# EAGLE design 1-1 (EAGLE 9.6.2)
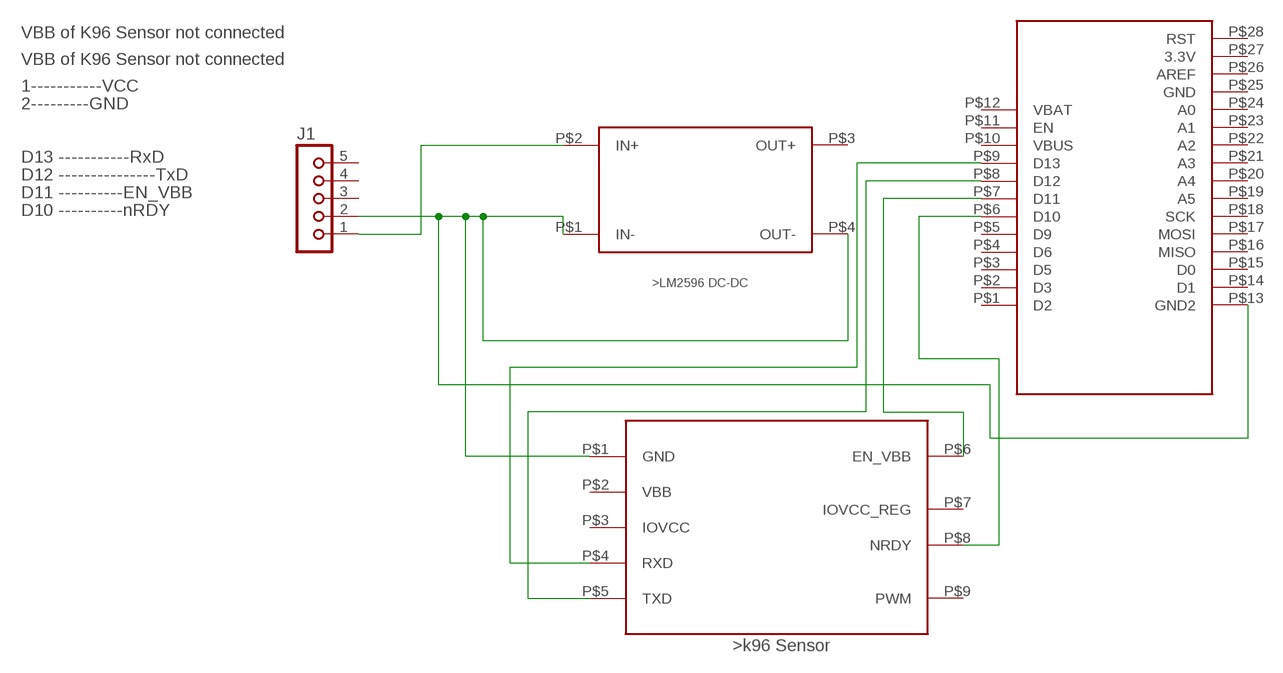
[diagram p0: schematic, sheet 1]

## Parts
DCDC1  DCDC  [DCDC]
FEATHER1  FEATHER  [FEATHER]
J1  JU05  [JU05]
K96SENSOR1  K96SENSOR  [K96SENSOR]

## Nets
N$1: DCDC1.P$2(IN+) J1.1
N$2: DCDC1.P$1(IN-) DCDC1.P$4(OUT-) FEATHER1.P$13(GND2) J1.2 K96SENSOR1.P$1(GND)
N$3: FEATHER1.P$6(D10) K96SENSOR1.P$8(NRDY)
N$5: FEATHER1.P$9(D13) K96SENSOR1.P$4(RXD)
N$6: FEATHER1.P$8(D12) K96SENSOR1.P$5(TXD)
N$7: FEATHER1.P$7(D11) K96SENSOR1.P$6(EN_VBB)
Unconnected: DCDC1.P$3(OUT+) FEATHER1.P$1(D2) FEATHER1.P$2(D3) FEATHER1.P$3(D5) FEATHER1.P$4(D6) FEATHER1.P$5(D9) FEATHER1.P$10(VBUS) FEATHER1.P$11(EN) FEATHER1.P$12(VBAT) FEATHER1.P$14(D1) FEATHER1.P$15(D0) FEATHER1.P$16(MISO) FEATHER1.P$17(MOSI) FEATHER1.P$18(SCK) FEATHER1.P$19(A5) FEATHER1.P$20(A4) FEATHER1.P$21(A3) FEATHER1.P$22(A2) FEATHER1.P$23(A1) FEATHER1.P$24(A0) FEATHER1.P$25(GND) FEATHER1.P$26(AREF) FEATHER1.P$27(3.3V) FEATHER1.P$28(RST) J1.3 J1.4 J1.5 K96SENSOR1.P$2(VBB) K96SENSOR1.P$3(IOVCC) K96SENSOR1.P$7(IOVCC_REG) K96SENSOR1.P$9(PWM)

## Notes on the sheet
- VBB of K96 Sensor not connected
- VBB of K96 Sensor not connected
- 1-----------VCC
- 2---------GND
- D13 -----------RxD
- D12 ---------------TxD
- D11 ----------EN_VBB
- D10 ----------nRDY

## Library data of the parts
DCDC1 = untitled:DCDC
FEATHER1 = untitled:FEATHER
J1 = con-lsta:JU05: PIN HEADER; OC_FARNELL: unknown; OC_NEWARK: unknown
K96SENSOR1 = untitled:K96SENSOR

## Board
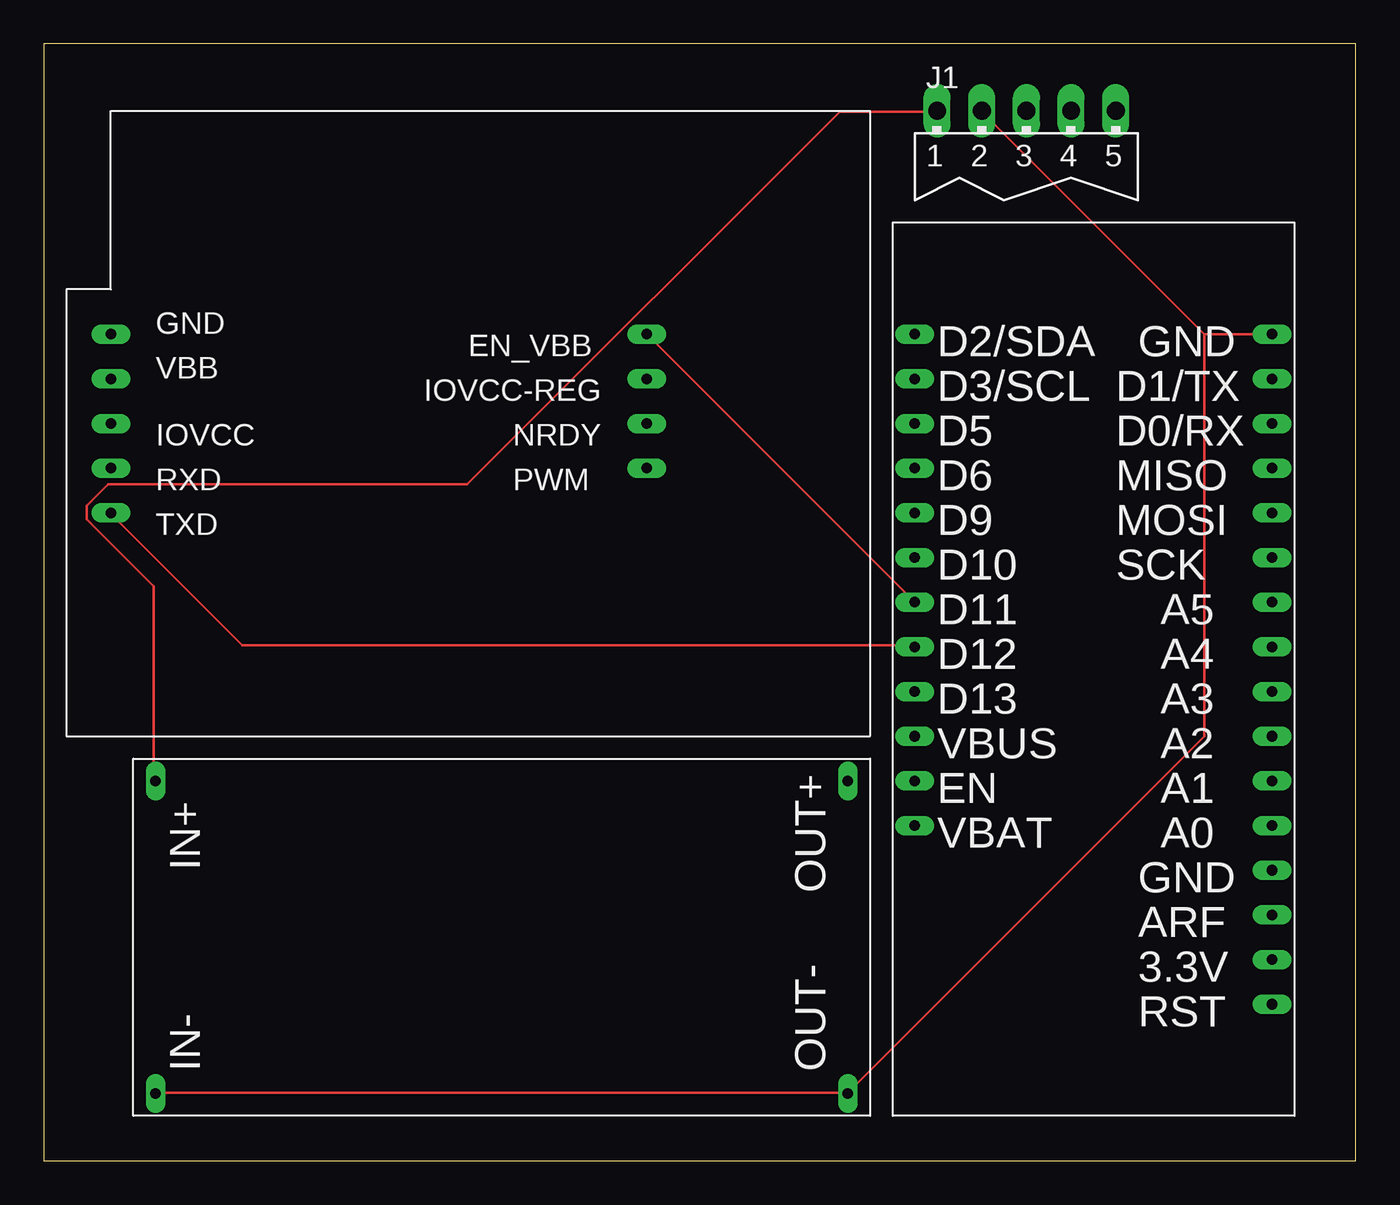
[diagram p1: board, top side]
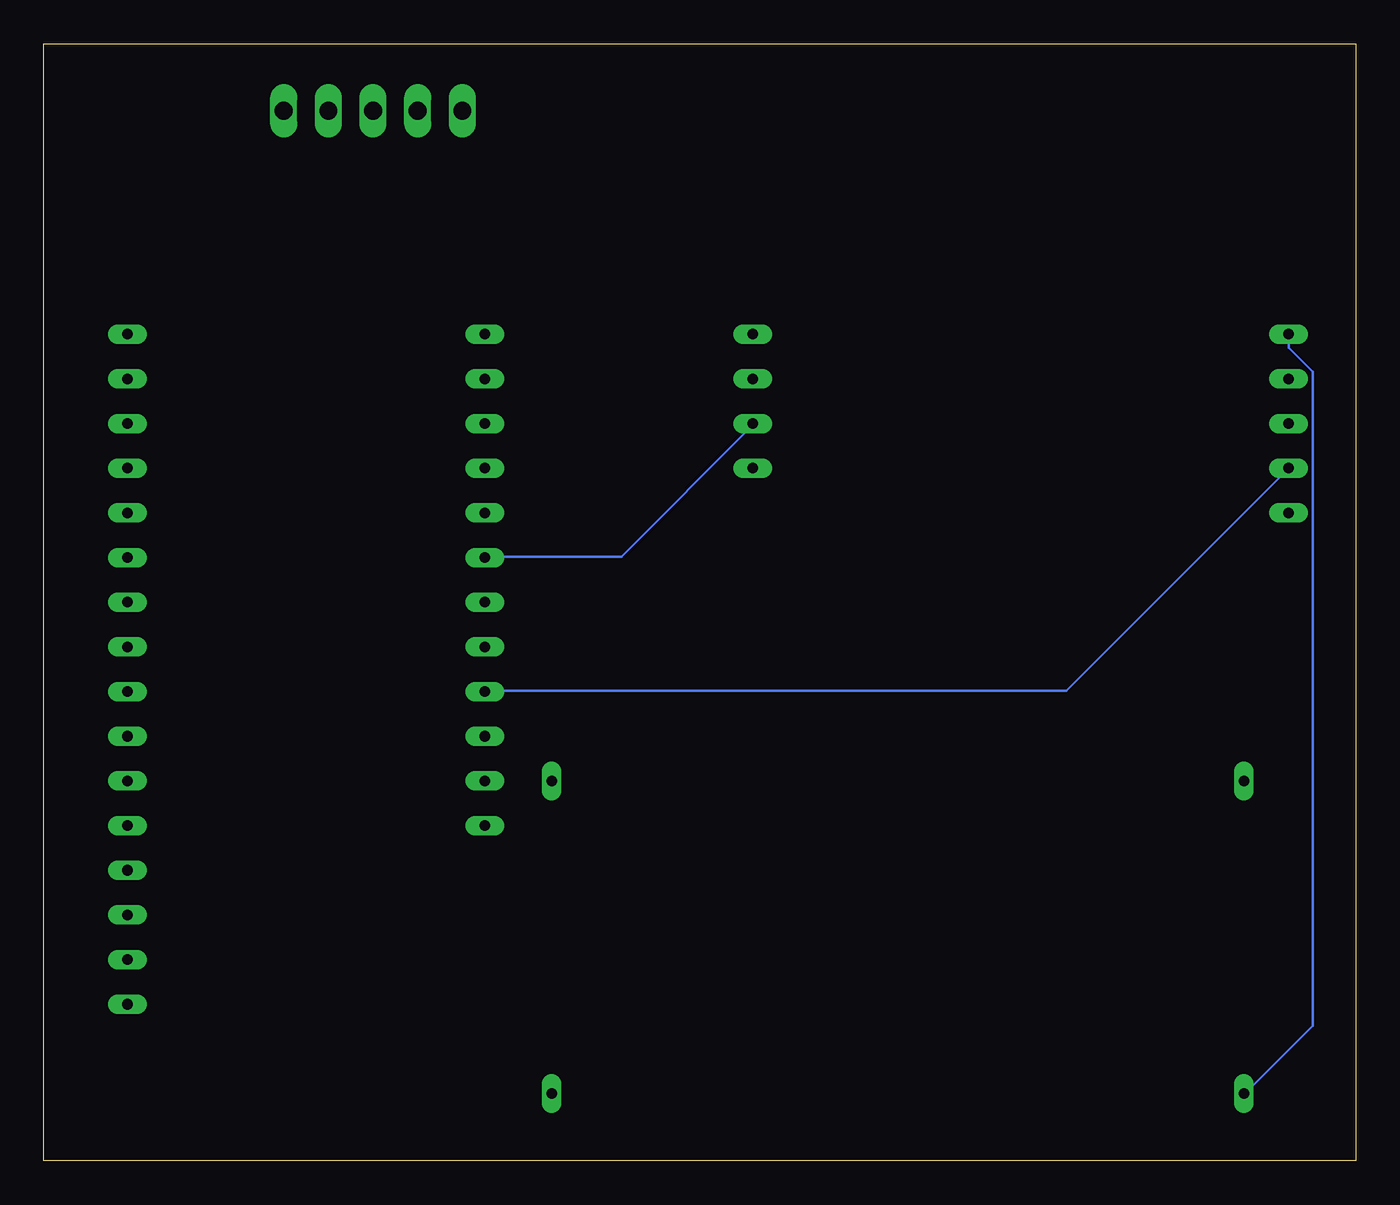
[diagram p2: board, bottom side, seen from below]

Size 74.6 x 63.49 mm. Coordinates in mm from the lower left corner, seen from the top.
Outline: 0,0 74.6,0 74.6,63.49 0,63.49 0,0
Copper layers (1*16): Top 0.035mm / dielectric 1.5mm / Bottom 0.035mm
Design rules "default": minimum track width 6mil, minimum drill 0.35mm, track to track 6mil, track to pad 6mil, pad to pad 6mil, via to via 6mil, smd to smd 6mil, copper to edge 40mil, drill to drill 6mil, minimum pad ring 10mil, minimum via ring 8mil, stop-mask expansion 4mil, vias tented up to drill 0mil, thermal gap 10mil

### Footprints (pad centres in the part's own frame; a part is rotated, then mirrored left to right if it is on the bottom)
DCDC = drill 0.6 long: P$1 -17.78,0; P$2 0,0; P$3 0,-39.37; P$4 -17.78,-39.37
FEATHER = drill 0.6 long: P$1 0,-5.08; P$2 0,-7.62; P$3 0,-10.16; P$4 0,-12.7; P$5 0,-15.24; P$6 0,-17.78; P$7 0,-20.32; P$8 0,-22.86; P$9 0,-25.4; P$10 0,-27.94; P$11 0,-30.48; P$12 0,-33.02; P$13 20.32,-5.08; P$14 20.32,-7.62; P$15 20.32,-10.16; P$16 20.32,-12.7; P$17 20.32,-15.24; P$18 20.32,-17.78; P$19 20.32,-20.32; P$20 20.32,-22.86; P$21 20.32,-25.4; P$22 20.32,-27.94; P$23 20.32,-30.48; P$24 20.32,-33.02; P$25 20.32,-35.56; P$26 20.32,-38.1; P$27 20.32,-40.64; P$28 20.32,-43.18
JU05 = drill 1.016 long: 1 -5.08,0; 2 -2.54,0; 3 0,0; 4 2.54,0; 5 5.08,0
K96SENSOR = drill 0.6 long: P$1 -17.78,-5.08; P$2 -17.78,-7.62; P$3 -17.78,-10.16; P$4 -17.78,-12.7; P$5 -17.78,-15.24; P$6 12.7,-5.08; P$7 12.7,-7.62; P$8 12.7,-10.16; P$9 12.7,-12.7

### Placement (x,y rotation side)
DCDC1  6.35,21.59 90 top
FEATHER1  49.53,52.07 0 top
J1  55.88,59.69 0 top
K96SENSOR1  21.59,52.07 0 top

### Tracks (layer width: path | path; a pad name or v marks a point on that pad's centre or on a via)
N$1
  Top 0.152: DCDC1.P$2 6.25,21.69 6.25,32.66 2.44,36.47 2.44,37.24 3.66,38.46 24.08,38.46 45.26,59.64 50.75,59.64 J1.1
N$2
  Top 0.152: 65.99,46.99 FEATHER1.P$13 | 65.99,46.99 53.34,59.64 J1.2 | 45.72,3.86 6.4,3.86 DCDC1.P$1 | 65.99,46.99 65.99,24.13 45.72,3.86 | 45.72,3.86 DCDC1.P$4
  Bottom 0.152: K96SENSOR1.P$1 3.81,46.23 2.44,44.86 2.44,7.67 6.25,3.86 DCDC1.P$1
N$3
  Bottom 0.152: FEATHER1.P$6 49.53,34.34 41.76,34.34 34.29,41.81 K96SENSOR1.P$8
N$5
  Bottom 0.152: K96SENSOR1.P$4 16.46,26.72 49.53,26.72 FEATHER1.P$9
N$6
  Top 0.152: FEATHER1.P$8 49.53,29.31 11.28,29.31 3.81,36.78 K96SENSOR1.P$5
N$7
  Top 0.152: K96SENSOR1.P$6 FEATHER1.P$7

### Text on the board
tValues: VCC | GND